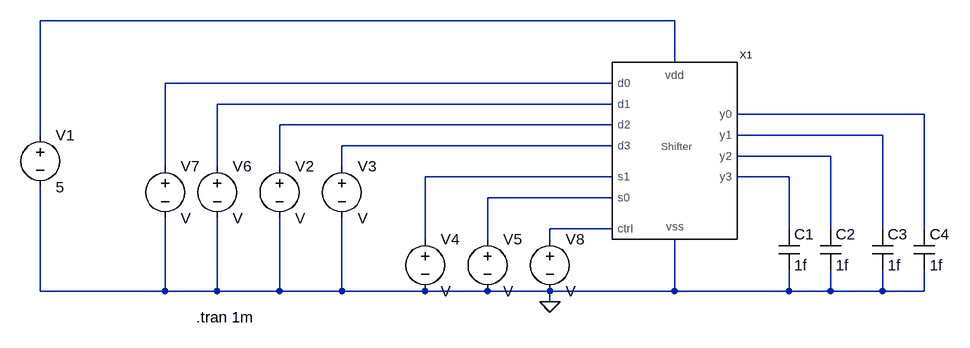
[diagram p0: schematic testbench-shifter.asc]
testbench-shifter.asc, the LTspice schematic file:
Version 4
SHEET 1 968 680
WIRE 192 -112 -784 -112
WIRE 192 -48 192 -112
WIRE 96 -16 -592 -16
WIRE 96 16 -512 16
WIRE 576 32 288 32
WIRE 96 48 -416 48
WIRE -784 64 -784 -112
WIRE 512 64 288 64
WIRE 96 80 -320 80
WIRE 432 96 288 96
WIRE -592 112 -592 -16
WIRE -512 112 -512 16
WIRE -416 112 -416 48
WIRE -320 112 -320 80
WIRE 96 128 -192 128
WIRE 368 128 288 128
WIRE 96 160 -96 160
WIRE 96 208 0 208
WIRE 368 208 368 128
WIRE 432 208 432 96
WIRE 512 208 512 64
WIRE 576 208 576 32
WIRE -192 224 -192 128
WIRE -96 224 -96 160
WIRE 0 224 0 208
WIRE -784 304 -784 144
WIRE -592 304 -592 192
WIRE -592 304 -784 304
WIRE -512 304 -512 192
WIRE -512 304 -592 304
WIRE -416 304 -416 192
WIRE -416 304 -512 304
WIRE -320 304 -320 192
WIRE -320 304 -416 304
WIRE -192 304 -320 304
WIRE -96 304 -192 304
WIRE 0 304 -96 304
WIRE 192 304 192 224
WIRE 192 304 0 304
WIRE 368 304 368 272
WIRE 368 304 192 304
WIRE 432 304 432 272
WIRE 432 304 368 304
WIRE 512 304 512 272
WIRE 512 304 432 304
WIRE 576 304 576 272
WIRE 576 304 512 304
WIRE 0 320 0 304
FLAG 0 320 0
SYMBOL voltage -784 48 R0
WINDOW 123 0 0 Left 0
WINDOW 39 0 0 Left 0
SYMATTR InstName V1
SYMATTR Value 5
SYMBOL cap 352 208 R0
SYMATTR InstName C1
SYMATTR Value 1f
SYMBOL shifter 192 16 R0
SYMATTR InstName X1
SYMBOL voltage -416 96 R0
SYMATTR InstName V2
SYMBOL voltage -320 96 R0
SYMATTR InstName V3
SYMBOL voltage -192 208 R0
SYMATTR InstName V4
SYMBOL voltage -96 208 R0
SYMATTR InstName V5
SYMBOL voltage -512 96 R0
SYMATTR InstName V6
SYMBOL voltage -592 96 R0
SYMATTR InstName V7
SYMBOL voltage 0 208 R0
SYMATTR InstName V8
SYMBOL cap 416 208 R0
SYMATTR InstName C2
SYMATTR Value 1f
SYMBOL cap 496 208 R0
SYMATTR InstName C3
SYMATTR Value 1f
SYMBOL cap 560 208 R0
SYMATTR InstName C4
SYMATTR Value 1f
TEXT -544 344 Left 2 !.tran 1m

The netlist it stands for:
* testbench-shifter.asc
V1 N001 0 5
C1 N010 0 1f
XX1 N002 N003 N005 N007 N004 N001 0 N009 N011 N006 N008 N010 N012 shifter  ; pins d0 d1 d2 d3 y0 vdd vss s1 s0 y1 y2 y3 ctrl
V2 N005 0 V
V3 N007 0 V
V4 N009 0 V
V5 N011 0 V
V6 N003 0 V
V7 N002 0 V
V8 N012 0 V
C2 N008 0 1f
C3 N006 0 1f
C4 N004 0 1f
.tran 1m
.backanno
.end